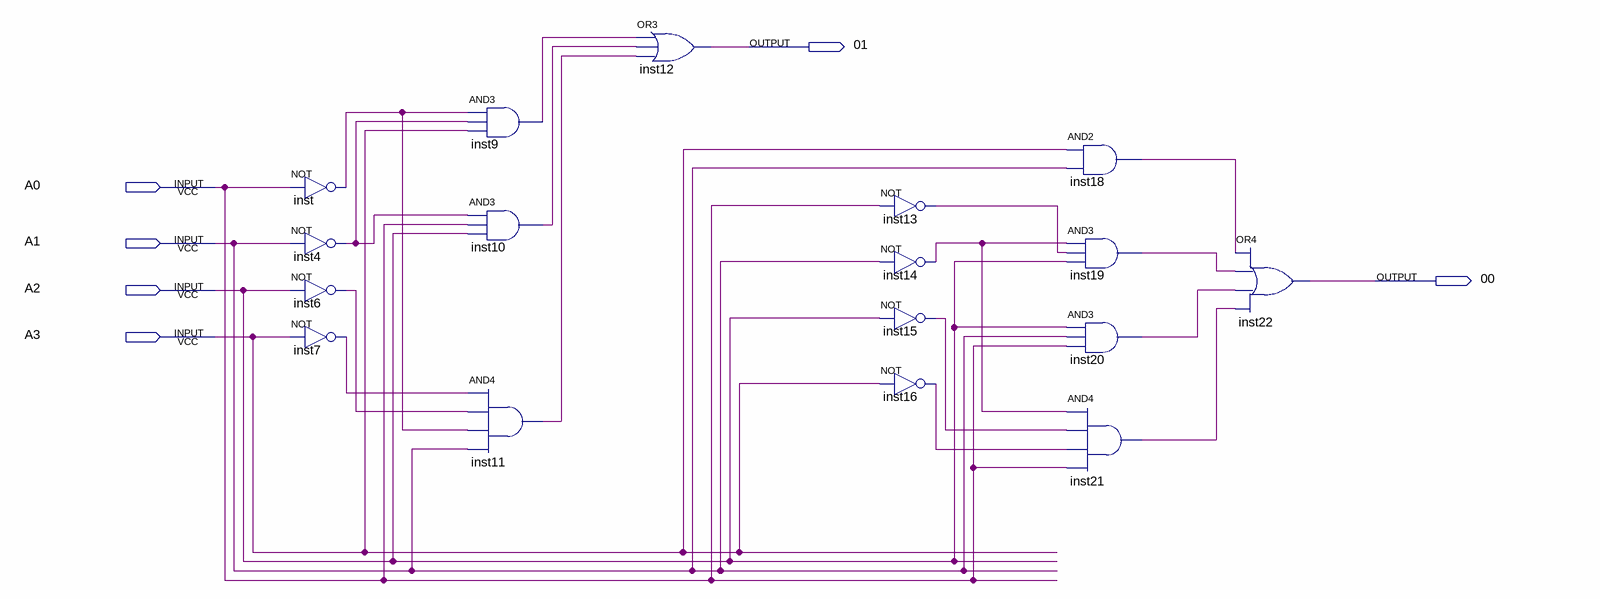
[diagram p0: schematic sheet]
// Quartus schematic Reminder3.bdf as structural Verilog: 17 symbols, 6 pins
module Reminder3 (
  input  A0,
  input  A1,
  input  A2,
  input  A3,
  output \01 ,
  output \00 
);

  wire inst4_out, inst6_out, inst7_out, inst9_out, inst10_out, inst11_out, inst13_out, inst14_out,
       inst15_out, inst16_out, inst18_out, inst19_out, inst20_out, inst21_out, inst_out;

  not inst (inst_out, A0);
  not inst4 (inst4_out, A1);
  not inst6 (inst6_out, A2);
  not inst7 (inst7_out, A3);
  and inst9 (inst9_out, inst_out, inst4_out, A3);
  and inst10 (inst10_out, inst4_out, A0, A2);
  and inst11 (inst11_out, inst7_out, inst6_out, inst_out, A1);
  or inst12 (\01 , inst9_out, inst10_out, inst11_out);
  not inst13 (inst13_out, A0);
  not inst14 (inst14_out, A1);
  not inst15 (inst15_out, A2);
  not inst16 (inst16_out, A3);
  and inst18 (inst18_out, A3, A1);
  and inst19 (inst19_out, inst14_out, inst13_out, A2);
  and inst20 (inst20_out, A2, A1, A0);
  and inst21 (inst21_out, inst14_out, inst15_out, inst16_out, A0);
  or inst22 (\00 , inst18_out, inst19_out, inst20_out, inst21_out);
endmodule
